# EasyEDA Pro project ProProject_运放实验_2024-09-24.epro, schematic Schematic4_1
Create Date: 2024-04-18; Page Name: P1; Project Name: 运放实验; Schematic Name: Schematic4_1; Update Date: 2024-04-18; Company: 嘉立创EDA; Page Size: A4; Version: V1.0
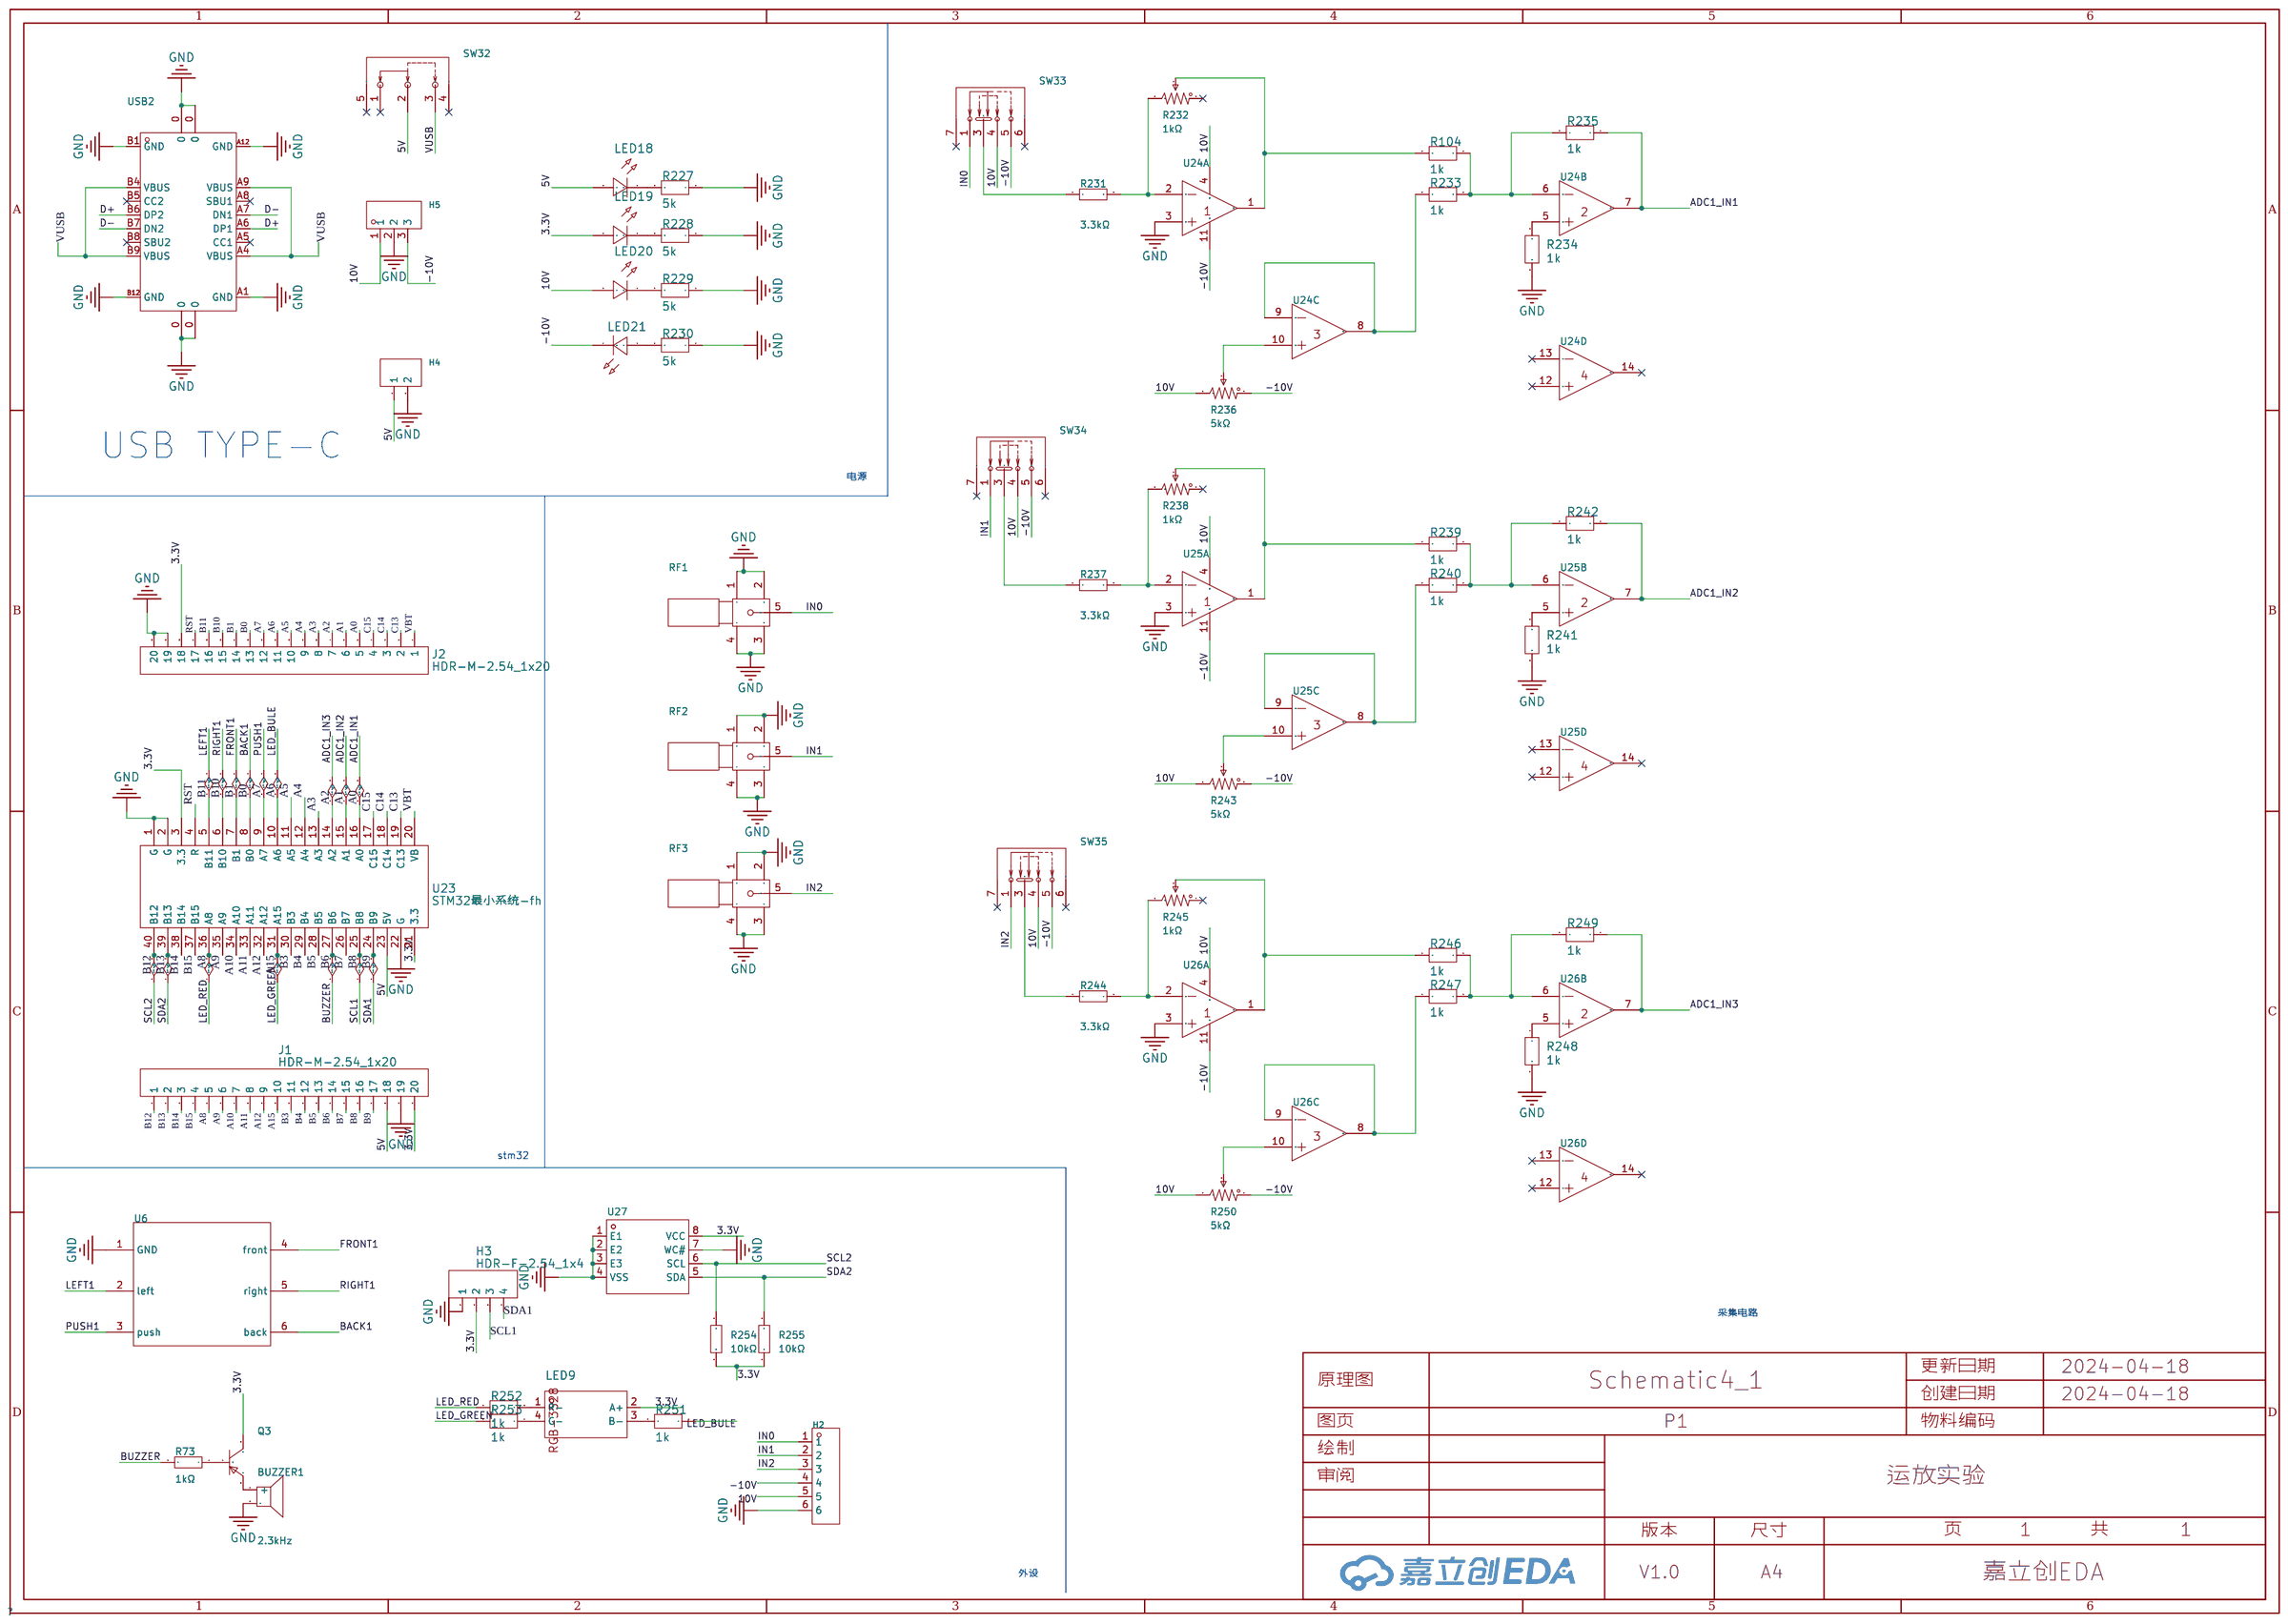
[diagram p2: schematic sheet]

## Parts
BUZZER1  2.3kHz  [BUZ-TH_BD12.0-P7.60-D0.6-FD]
H2  PM254V-11-06-H85  [HDR-TH_6P-P2.54-V-F]
H3  HDR-F-2.54_1x4  [HDR-F-2.54_1X4]
H4  -  [HDR-TH_2P-P2.54-V-F]
H5  -  [HDR-TH_3P-P2.54-V-F]
J1  HDR-M-2.54_1x20  [HDR-M-2.54_1X20]
J2  HDR-M-2.54_1x20  [HDR-M-2.54_1X20]
LED9  LED-RGB-3528  [LED 3528-4PIN]
LED18  -  [LED_0805]
LED19  -  [LED_0805]
LED20  -  [LED_0805]
LED21  -  [LED_0805]
Q3  S8550  [SOT-23-3_L2.9-W1.3-P1.90-LS2.4-BR]
R73  1kΩ  [R0603]
R104  1k  [R0805]
R227  5k  [R0805]
R228  5k  [R0805]
R229  5k  [R0805]
R230  5k  [R0805]
R231  3.3kΩ  [R0603]
R232  1kΩ  [RES-ADJ-TH_3P-L10.0-W10.0-P2.50-BL-BS]
R233  1k  [R0805]
R234  1k  [R0805]
R235  1k  [R0805]
R236  5kΩ  [RES-ADJ-TH_3P-L9.5-W4.85-P2.50-BL-BS]
R237  3.3kΩ  [R0603]
R238  1kΩ  [RES-ADJ-TH_3P-L10.0-W10.0-P2.50-BL-BS]
R239  1k  [R0805]
R240  1k  [R0805]
R241  1k  [R0805]
R242  1k  [R0805]
R243  5kΩ  [RES-ADJ-TH_3P-L9.5-W4.85-P2.50-BL-BS]
R244  3.3kΩ  [R0603]
R245  1kΩ  [RES-ADJ-TH_3P-L10.0-W10.0-P2.50-BL-BS]
R246  1k  [R0805]
R247  1k  [R0805]
R248  1k  [R0805]
R249  1k  [R0805]
R250  5kΩ  [RES-ADJ-TH_3P-L9.5-W4.85-P2.50-BL-BS]
R251  1k  [R0805]
R252  1k  [R0805]
R253  1k  [R0805]
R254  10kΩ  [R0603]
R255  10kΩ  [R0603]
RF1  BWSMA-KWE-Z001  [SMA-TH_BWSMA-KWE-Z001]
RF2  BWSMA-KWE-Z001  [SMA-TH_BWSMA-KWE-Z001]
RF3  BWSMA-KWE-Z001  [SMA-TH_BWSMA-KWE-Z001]
SW32  SK12D07VG4  [SW-TH_SK12D07VG4]
SW33  SK13D07VG4  [SW-TH_SK13D07VG4]
SW34  SK13D07VG4  [SW-TH_SK13D07VG4]
SW35  SK13D07VG4  [SW-TH_SK13D07VG4]
U6  -  [直插五向开关]
U23  STM32最小系统-fh  [STM32最小系统板]
U24  LM324DT  [SOIC-14_L8.7-W3.9-P1.27-LS6.0-BL]  (sections 1,2,3,4)
U25  LM324DT  [SOIC-14_L8.7-W3.9-P1.27-LS6.0-BL]  (sections 1,2,3,4)
U26  LM324DT  [SOIC-14_L8.7-W3.9-P1.27-LS6.0-BL]  (sections 1,2,3,4)
U27  M24C02-WMN6TP  [SOIC-8_L4.9-W3.9-P1.27-LS6.0-BL]
USB2  -  [USB-C_SMD-TYPE-C-31-M-12]

## Library data of the parts
BUZZER1 = TMB12A05_C96093: 驱动方式:有源(内含驱动线路);构造类型:电磁式;额定电压:5V;频率:2.3kHz;声压(SPL):85dB@5V,10cm;; LCSC Part Name: TMB12A05; Supplier Part: C96093; Manufacturer: 华能; Manufacturer Part: TMB12A05; Supplier Footprint: 插件,D=12mm; JLCPCB Part Class: 扩展库; Datasheet: https://atta.szlcsc.com/upload/public/pdf/source/20170522/1495448324811.pdf; Supplier: LCSC; Oscillator Circuit: 有源(内含驱动线路); Technology Type: 电磁式; Rated Voltage: 5V; Operating Voltage: 4V~8V; Sound Pressure Level (SPL): 85dB@5V,10cm; Diameter (φD): 12mm; Height: 9.8mm
H2 = PM254V-11-06-H85: 排数:单排;总孔位数:6P;间距:2.54mm;插孔结构:1x6P;行距:-;安装类型:直插;圆孔/方孔:方孔;额定电流:3A;额定电压:250V;插孔方向:顶部;塑高:-;工作温度范围:-40℃~+105℃;; LCSC Part Name: 2.54mm 1x6P; Supplier Part: C2832269; Manufacturer: XFCN(兴飞); Supplier Footprint: 插件,P=2.54mm; JLCPCB Part Class: 扩展库; Datasheet: https://atta.szlcsc.com/upload/public/pdf/source/20210514/C2832269_B3EC97736B37C2783BDCE3050AA57447.pdf; Supplier: LCSC; Number of Rows: 单排; Number of Holes: 6P; Pitch: 2.54mm; Holes Structure: 1x6P; Mounting Type: 直插; Circular Hole / Square Hole: 方孔; Current Rating (Max): 3A; Voltage Rating (Max): 250V; Holes Direction: 顶部; Operating Temperature Range: -40℃~+105℃
H3 = HDR-F-2.54_1x4: Supplier Part: C225501; Supplier: LCSC
H4 = HDR-F_2.54_1x2P: Supplier Part: C49661; Supplier Footprint: 插件
H5 = HDR-F_2.54_1x3P: Supplier Part: C541850; Supplier Footprint: 插件
J1 J2 = HDR-M-2.54_1x20: Supplier Part: C50981; Supplier: LCSC
LED9 = ?
LED18-LED21 = LED_0805-R: Supplier Footprint: 0805
Q3 = S8550_C2891805: Supplier Part: C2891805; Manufacturer: YONGYUTAI(永裕泰); Supplier Footprint: SOT-23; JLCPCB Part Class: 扩展库; Datasheet: https://atta.szlcsc.com/upload/public/pdf/source/20210901/65C3C4D1695A9271DEFEFE0B623CB3B1.pdf; Supplier: LCSC
R73 = 0603WAF1001T5E: 电阻类型:厚膜电阻;阻值:1kΩ;精度:±1%;功率:100mW;; LCSC Part Name: 1kΩ ±1% 100mW; Supplier Part: C21190; Manufacturer: UNI-ROYAL(厚声); Supplier Footprint: 0603; JLCPCB Part Class: Basic Part; Datasheet: https://atta.szlcsc.com/upload/public/pdf/source/20200306/C422600_1E6D84923E4A46A82E41ADD87F860B5C.pdf; Supplier: LCSC; Type: 厚膜电阻; Tolerance: ±1%; Power(Watts): 100mW; Temperature Coefficient: ±100ppm/℃; Overload Voltage (Max): 75V; Operating Temperature Range: -55℃~+155℃
R104 R227-R230 R233-R235 R239-R242 R246-R249 R251-R253 = 1k
R231 R237 R244 = 0603WAF3301T5E: 电阻类型:厚膜电阻;阻值:3.3kΩ;精度:±1%;功率:100mW;最大工作电压:75V;温度系数:±100ppm/℃;; LCSC Part Name: 3.3kΩ ±1% 100mW 厚膜电阻; Supplier Part: C22978; Manufacturer: UNI-ROYAL(厚声); Supplier Footprint: 0603; JLCPCB Part Class: Basic Part; Datasheet: https://atta.szlcsc.com/upload/public/pdf/source/20200306/C422600_1E6D84923E4A46A82E41ADD87F860B5C.pdf; Supplier: LCSC; Type: 厚膜电阻; Tolerance: ±1%; Power(Watts): 100mW; Overload Voltage (Max): 75V; Temperature Coefficient: ±100ppm/℃; Operating Temperature Range: -55℃~+155℃
R232 R238 R245 = 3296W-1-102: 阻值:1kΩ;精度:±10%;; LCSC Part Name: 1kΩ ±10%; Supplier Part: C118949; Manufacturer: BOCHEN(博晨); Supplier Footprint: 插件; JLCPCB Part Class: 扩展库; Datasheet: https://atta.szlcsc.com/upload/public/pdf/source/20171114/C118949_15106326635991117438.pdf; Supplier: LCSC; Tolerance: ±10%
R236 R243 R250 = 3296W-1-502: 阻值:5kΩ;精度:±10%;; LCSC Part Name: 5kΩ ±10%; Supplier Part: C118907; Manufacturer: BOCHEN(博晨); Supplier Footprint: 插件; JLCPCB Part Class: 扩展库; Datasheet: https://atta.szlcsc.com/upload/public/pdf/source/20171114/C118907_15106326547951117397.pdf; Supplier: LCSC; Tolerance: ±10%
R254 R255 = 0603WAF1002T5E: 电阻类型:厚膜电阻;阻值:10kΩ;精度:±1%;功率:100mW;; LCSC Part Name: 厚膜电阻 10kΩ ±1% 100mW; Supplier Part: C25804; Manufacturer: UNI-ROYAL(厚声); Supplier Footprint: 0603; JLCPCB Part Class: 基础库; Datasheet: https://atta.szlcsc.com/upload/public/pdf/source/20200306/C422600_1E6D84923E4A46A82E41ADD87F860B5C.pdf; Supplier: LCSC; Type: 厚膜电阻; Tolerance: ±1%; Power(Watts): 100mW; Temperature Coefficient: ±100ppm/℃; Overload Voltage (Max): 75V; Operating Temperature Range: -55℃~+155℃
RF1-RF3 = BWSMA-KWE-Z001: 连接器类型:板端;接口类型:内孔;端口数量:1;接口直径:5.3mm;接口长度/高度:-;频率-最大值:-;射频系列:SMA;阻抗:50Ω;样式:弯头;触头材质:-;触头镀层:-;工作温度范围:-;焊接温度(最大值):-;; LCSC Part Name: 内孔 SMA 弯头; Supplier Part: C496551; Manufacturer: BAT WIRELESS(蝙蝠无线); Supplier Footprint: 插件; JLCPCB Part Class: 扩展库; Datasheet: https://atta.szlcsc.com/upload/public/pdf/source/20231017/997A8C2ADA7F8034A89BE1264F38CE52.pdf; Supplier: LCSC; Connector Type: 板端; Interface Type: 内孔; Number of Ports: 1; Interface Diameter: 5.3mm; RF Series: SMA; Impedance: 50Ω; Style: 弯头
SW32 = SK12D07VG4: 额定电压 DC:50V;触点额定电流:500mA @ 50VDC;电路结构:SPDT;额定电压 AC:-;开关功能:On-On;; LCSC Part Name: 3脚2二档位SK12D07VG4滑动开关1P2T卧式拨动开关; Supplier Part: C393937; Manufacturer: SHOU HAN(首韩); Supplier Footprint: 插件,P=2mm; JLCPCB Part Class: 扩展库; Supplier: LCSC; Operating Force: 130~330gf; Contact Material: Brass; Rated Voltage(DC): 50V; Contact Rating @ Voltage: 500mA @ 50VDC; Circuit: SPDT; Electrical Life Cycles: 5000; Mounting Type: Through Hole, Right Angle; Switch Function: On-On; Switch Height: 4mm; Actuator Orientation: Horizontal; Contact Timing: Shorting (MBB); Termination Style: PC 引脚; Actuator Type: Standard
SW33-SW35 = SK13D07VG4: 电路结构:单刀三掷;安装方式:侧插;开关颜色:-;额定电流(DC):300mA;额定电压(DC):50V;额定电流(AC):-;额定电压(AC):-;机械寿命:5千次;; LCSC Part Name: 4脚3三档位SK13D07VG2 1P3T卧式拨动开关,柄长4MM; Supplier Part: C2681581; Manufacturer: SHOU HAN(首韩); Supplier Footprint: 插件; JLCPCB Part Class: 扩展库; Datasheet: https://atta.szlcsc.com/upload/public/pdf/source/20210224/C2681581_976B40BF7B723A53FF2B4716D1A8276E.pdf; Supplier: LCSC; Circuit: 单刀三掷; Pin Style: PC引脚; Switch Length: 12.6mm; Switch Width: 4.4mm; Switch Height: 4.7mm; Mounting Style: 侧插; Current Rating (DC): 300mA; Voltage Rating (DC): 50V; Mechanical Life: 5千次; Operating Temperature: -10℃~+50℃
U6 = 直插五向开关
U23 = STM32最小系统-fh
U24-U26 = LM324DT: 放大器数:四路;增益带宽积(GBP):1.3MHz;输入偏置电流(Ib):20nA;压摆率(SR):0.4V/us;带宽(-3db):-;; Supplier Part: C71035; Manufacturer: ST(意法半导体); Supplier Footprint: SOIC-14; JLCPCB Part Class: 基础库; Datasheet: https://atta.szlcsc.com/upload/public/pdf/source/20160408/1460100649718.pdf; Supplier: LCSC; Number of Circuits: 四路; Gain Bandwidth Product(GBP): 1.3MHz; Current - Input Bias(Ib): 20nA; Slew Rate(SR): 0.4V/us; Output Current: 40mA; Supply Current: 1.5mA; Operating Temperature: 0℃~+70℃
U27 = M24C02-WMN6TP: 接口类型:I2C;存储容量:2Kbit;; Supplier Part: C7562; Manufacturer: ST(意法半导体); Supplier Footprint: SOIC-8; JLCPCB Part Class: Extended Part; Datasheet: https://atta.szlcsc.com/upload/public/pdf/source/20140724/1457707167301.pdf; Supplier: LCSC; Interface Type: I2C; Memory Size: 2Kbit; Supply Voltage: 2.5V~5.5V; Operating Temperature: -40℃~+85℃
USB2 = TYPE-C-31-M-12: 连接器类型:Type-C;标准:-;公母:母座;触点数量:16;端口数量:1;额定电流 - 电源:250mA;; Supplier Part: C165948; Manufacturer: 韩国韩荣; JLCPCB Part Class: Extended Part; Datasheet: https://atta.szlcsc.com/upload/public/pdf/source/20210111/C2682493_D8CCFED08835E878D16ACCF4460E43B8.pdf; Supplier: LCSC; Connector Type: Type-C; Gender: 母座; Number of Contacts: 16; Number of Ports: 1; Current Rating - Power (Max): 250mA

## Nets
3.3V: H3.2 J1.20 J2.18 LED9.2(A+) LED19.2(A) Q3.3(C) R254.1 R255.1 U23.3(3.3) U23.21(3.3) U27.8(VCC)
5V: H4.1 J1.18 LED18.2(A) SW32.2 U23.23(5V)
10V: H2.5 H5.1 LED20.2(A) R236.3 R243.3 R250.3 SW33.4 SW34.4 SW35.4 U24.4(VCC+) U25.4(VCC+) U26.4(VCC+)
-10V: H2.4 H5.3 LED21.1(C) R236.1 R243.1 R250.1 SW33.5 SW34.5 SW35.5 U24.11(VCC-) U25.11(VCC-) U26.11(VCC-)
GND: BUZZER1.2 H2.6 H3.1 H4.2 H5.2 J1.19 J2.19 J2.20 R227.1 R228.1 R229.1 R230.1 R234.2 R241.2 R248.2 RF1.1 RF1.2 RF1.3 RF1.4 RF2.1 RF2.2 RF2.3 RF2.4 RF3.1 RF3.2 RF3.3 RF3.4 U6.1(GND) U23.1(G) U23.2(G) U23.22(G) U24.3(IN1+) U25.3(IN1+) U26.3(IN1+) U27.1(E1) U27.2(E2) U27.3(E3) U27.4(VSS) U27.7(WC#) USB2.0 USB2.A1(GND) USB2.A12(GND) USB2.B1(GND) USB2.B12(GND)
A0: J2.5 R235.1 U23.16(A0) U24.7(OUT2)
A1: J2.6 R242.1 U23.15(A1) U25.7(OUT2)
A2: J2.7 R249.1 U23.14(A2) U26.7(OUT2)
A3: J2.8 U23.13(A3)
A4: J2.9 U23.12(A4)
A5: J2.10 U23.11(A5)
A6: J2.11 R251.1 U23.10(A6)
A7: J2.12 U6.3(push) U23.9(A7)
A8: J1.5 R252.1 U23.36(A8)
A9: J1.6 U23.35(A9)
A10: J1.7 U23.34(A10)
A11: J1.8 U23.33(A11)
A12: J1.9 U23.32(A12)
A15: J1.10 R253.2 U23.31(A15)
B0: J2.13 U6.6(back) U23.8(B0)
B1: J2.14 U6.4(front) U23.7(B1)
B3: J1.11 U23.30(B3)
B4: J1.12 U23.29(B4)
B5: J1.13 U23.28(B5)
B6: J1.14 R73.2 U23.27(B6)
B7: J1.15 U23.26(B7)
B8: H3.3 J1.16 U23.25(B8)
B9: H3.4 J1.17 U23.24(B9)
B10: J2.15 U6.5(right) U23.6(B10)
B11: J2.16 U6.2(left) U23.5(B11)
B12: J1.1 R254.2 U23.40(B12) U27.6(SCL)
B13: J1.2 R255.2 U23.39(B13) U27.5(SDA)
B14: J1.3 U23.38(B14)
B15: J1.4 U23.37(B15)
C13: J2.2 U23.19(C13)
C14: J2.3 U23.18(C14)
C15: J2.4 U23.17(C15)
D+: USB2.A6(DP1) USB2.B6(DP2)
D-: USB2.A7(DN1) USB2.B7(DN2)
IN0: H2.1 RF1.5 SW33.1
IN1: H2.2 RF2.5 SW34.1
IN2: H2.3 RF3.5 SW35.1
RST: J2.17 U23.4(R)
VBT: J2.1 U23.20(VB)
VUSB: SW32.3 USB2.A4(VBUS) USB2.A9(VBUS) USB2.B4(VBUS) USB2.B9(VBUS)
$1N26843: LED18.1(C) R227.2
$1N34324: LED19.1(C) R228.2
$1N34388: LED20.1(C) R229.2
$1N34463: LED21.2(A) R230.2
$1N35600: R231.2 R232.3 U24.2(IN1-)
$1N35703: R104.2 R232.2 U24.1(OUT1)
$1N35742: R234.1 U24.5(IN2+)
$1N35778: R104.1 R233.1 R235.2 U24.6(IN2-)
$1N35814: R233.2 U24.8(OUT3) U24.9(IN3-)
$1N35912: R236.2 U24.10(IN3+)
$1N36717: R237.2 R238.3 U25.2(IN1-)
$1N36723: R238.2 R239.2 U25.1(OUT1)
$1N36728: R241.1 U25.5(IN2+)
$1N36732: R239.1 R240.1 R242.2 U25.6(IN2-)
$1N36743: R240.2 U25.8(OUT3) U25.9(IN3-)
$1N36755: R243.2 U25.10(IN3+)
$1N37159: R244.1 SW35.3
$1N37162: R244.2 R245.3 U26.2(IN1-)
$1N37168: R245.2 R246.2 U26.1(OUT1)
$1N37173: R248.1 U26.5(IN2+)
$1N37177: R246.1 R247.1 R249.2 U26.6(IN2-)
$1N37188: R247.2 U26.8(OUT3) U26.9(IN3-)
$1N37200: R250.2 U26.10(IN3+)
$1N37656: R231.1 SW33.3
$1N37740: R237.1 SW34.3
$1N37992: Q3.1(B) R73.1
$1N38351: BUZZER1.1(+) Q3.2(E)
$1N40250: LED9.3(B-) R251.2
$1N40252: LED9.1(R-) R252.2
$1N40254: LED9.4(G-) R253.1

Not connected (* = marked no-connect by the designer): R232 1*; R238 1*; R245 1*; SW32 1* 4* 5*; SW33 6* 7*; SW34 6* 7*; SW35 6* 7*; U24 12(IN4+)* 13(IN4-)* 14(OUT4)*; U25 12(IN4+)* 13(IN4-)* 14(OUT4)*; U26 12(IN4+)* 13(IN4-)* 14(OUT4)*; USB2 A5(CC1)* A8(SBU1)* B5(CC2)* B8(SBU2)*

## Notes on the sheet
- USB TYPE-C
- 电源
- stm32
- 采集电路
- 外设
